# EAGLE schematic circuit (EAGLE 6.2)
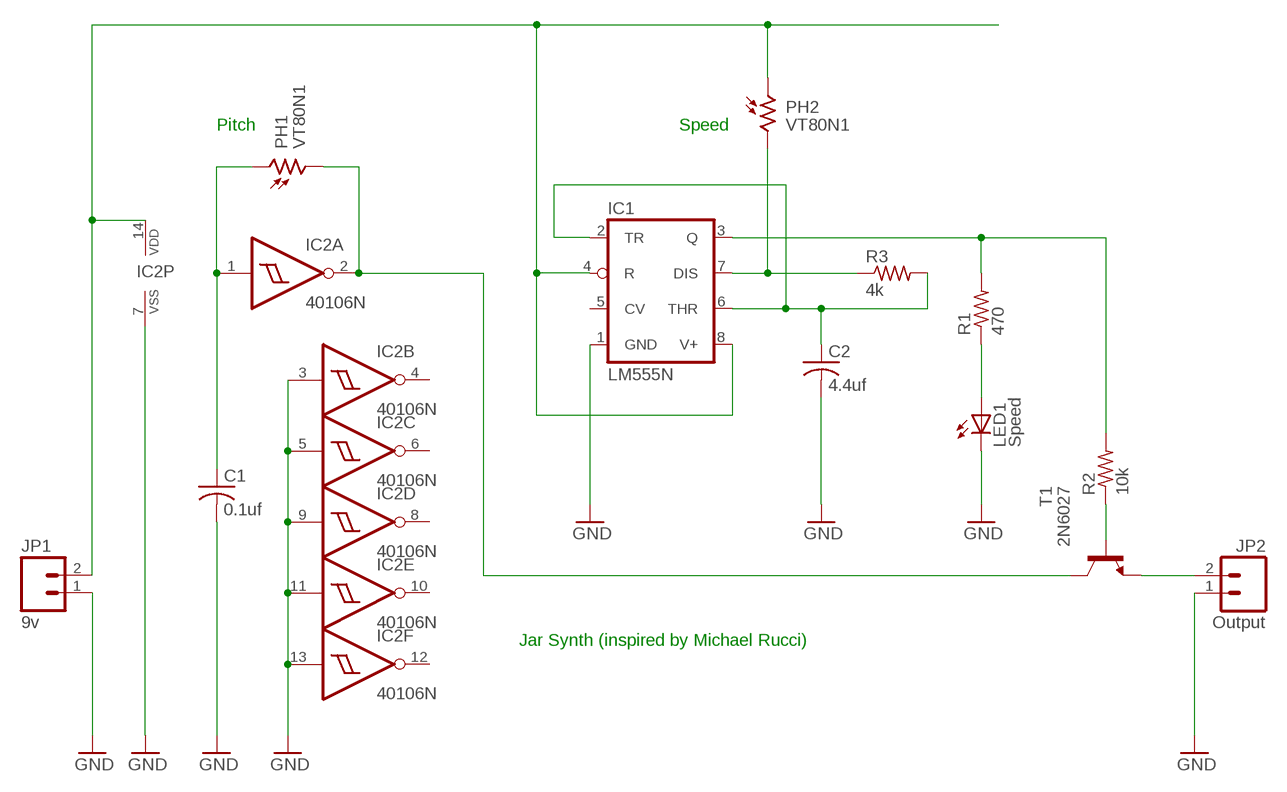
[diagram p0: schematic, sheet 1]

## Parts
C1  0.1uf  C-US050-025X075  [C050-025X075]
C2  4.4uf  C-US050-025X075  [C050-025X075]
IC1  LM555N  [DIL08]
IC2  40106N  [DIL14]
JP1  9v  M02PTH  [1X02]
JP2  Output  M02PTH  [1X02]
LED1  Speed  LED5MM  [LED5MM]
PH1  VT80N1  [VT800]
PH2  VT80N1  [VT800]
R1  470  R-US_0207/7  [0207/7]
R2  10k  R-US_0207/7  [0207/7]
R3  4k  R-US_0207/7  [0207/7]
T1  2N6027  2SC458  [TO92-ECB]

## Nets
GND: C1.2 C2.2 IC1.1(GND) IC2.3(B:I) IC2.5(C:I) IC2.7(P:VSS) IC2.9(D:I) IC2.11(E:I) IC2.13(F:I) JP1.1 JP2.1 LED1.K(C)
N$1: IC1.4(R) IC1.8(V+) IC2.14(P:VDD) JP1.2 PH2.1
N$2: R2.1 T1.B
N$3: JP2.2 T1.E
N$4: LED1.A R1.1
N$5: C1.1 IC2.1(A:I) PH1.1
N$6: IC2.2(A:O) PH1.2 T1.C
N$7: IC1.7(DIS) PH2.2 R3.1
N$8: C2.1 IC1.2(TR) IC1.6(THR) R3.2
N$9: IC1.3(Q) R1.2 R2.2
Unconnected: IC1.5(CV) IC2.4(B:O) IC2.6(C:O) IC2.8(D:O) IC2.10(E:O) IC2.12(F:O)

## Notes on the sheet
- Pitch | Speed
- Jar Synth (inspired by Michael Rucci)

## Library data of the parts
C1 C2 = resistor:C-US: CAPACITOR, American symbol
IC1 = linear:*555: TIMER
IC2 = 40xx:40106: Hex SCHMITT TRIGGER
JP1 JP2 = SparkFun-Connectors:M02: Header 2 Standard 2-pin 0.1" header. Use with straight break away headers (SKU : PRT-00116), right angle break away headers (PRT-00553), swiss pins (PRT-00743), machine pins (PRT-00117), and female headers (PRT-00115). Molex polarized connector foot print use with SKU : PRT-08233 with associated crimp pins and housings.
LED1 = led:LED: LED OSRAM: - CHIPLED LG R971, LG N971, LY N971, LG Q971, LY Q971, LO R971, LY R971 LH N974, LH R974 LS Q976, LO Q976, LY Q976 LO Q996 - Hyper CHIPLED LW Q18S LB Q993, LB Q99A, LB R99A - SideLED LS A670, LO A670, LY A670, LG A670, LP A670 LB A673, LV A673, LT A673, LW A673 LH A674 LY A675 LS A676, LA A676, LO A676, LY A676, LW A676 LS A679, LY A679, LG A679 - Hyper Micro SIDELED® LS Y876, LA Y876, LO Y876, LY Y876 LT Y87S - SmartLED LW L88C, LW L88S LB L89C, LB L89S, LG L890 LS L89K, LO L89K, LY L89K LS L896, LA L896, LO L896, LY L896 - TOPLED LS T670, LO T670, LY T670, LG T670, LP T670 LSG T670, LSP T670, LSY T670, LOP T670, LYG T670 LG T671, LOG T671, LSG T671 LB T673, LV T673, LT T673, LW T673 LH T674 LS T676, LA T676, LO T676, LY T676, LB T676, LH T676, LSB T676, LW T676 LB T67C, LV T67C, LT T67C, LS T67K, LO T67K, LY T67K, LW E67C LS E67B, LA E67B, LO E67B, LY E67B, LB E67C, LV E67C, LT E67C LW T67C LS T679, LY T679, LG T679 LS T770, LO T770, LY T770, LG T770, LP T770 LB T773, LV T773, LT T773, LW T773 LH T774 LS E675, LA E675, LY E675, LS T675 LS T776, LA T776, LO T776, LY T776, LB T776 LHGB T686 LT T68C, LB T68C - Hyper Mini TOPLED® LB M676 - Mini TOPLED Santana® LG M470 LS M47K, LO M47K, LY M47K Source: http://www.osram.convergy.de LUXEON: - LUMILED® LXK2-PW12-R00, LXK2-PW12-S00, LXK2-PW14-U00, LXK2-PW14-V00 LXK2-PM12-R00, LXK2-PM12-S00, LXK2-PM14-U00 LXK2-PE12-Q00, LXK2-PE12-R00, LXK2-PE12-S00, LXK2-PE14-T00, LXK2-PE14-U00 LXK2-PB12-K00, LXK2-PB12-L00, LXK2-PB12-M00, LXK2-PB14-N00, LXK2-PB14-P00, LXK2-PB14-Q00 LXK2-PR12-L00, LXK2-PR12-M00, LXK2-PR14-Q00, LXK2-PR14-R00 LXK2-PD12-Q00, LXK2-PD12-R00, LXK2-PD12-S00 LXK2-PH12-R00, LXK2-PH12-S00 LXK2-PL12-P00, LXK2-PL12-Q00, LXK2-PL12-R00 Source: www.luxeon.com KINGBRIGHT: KA-3528ASYC Source: www.kingbright.com
PH1 PH2 = photo-elements:VT8: Photoconductive Cell VT800 Series Source: http://optoelectronics.perkinelmer.com/content/Datasheets/DTS_vt800seriesdatasheet.pdf
R1-R3 = resistor:R-US_: RESISTOR, American symbol
T1 = transistor:2SC458: NPN Silicon Epitaxial Planar Transistor Source: SEMTECH ELECTRONICS LTD. ... 2SC458 1.pdf